# EAGLE design Robot arm (EAGLE 8.4.2)
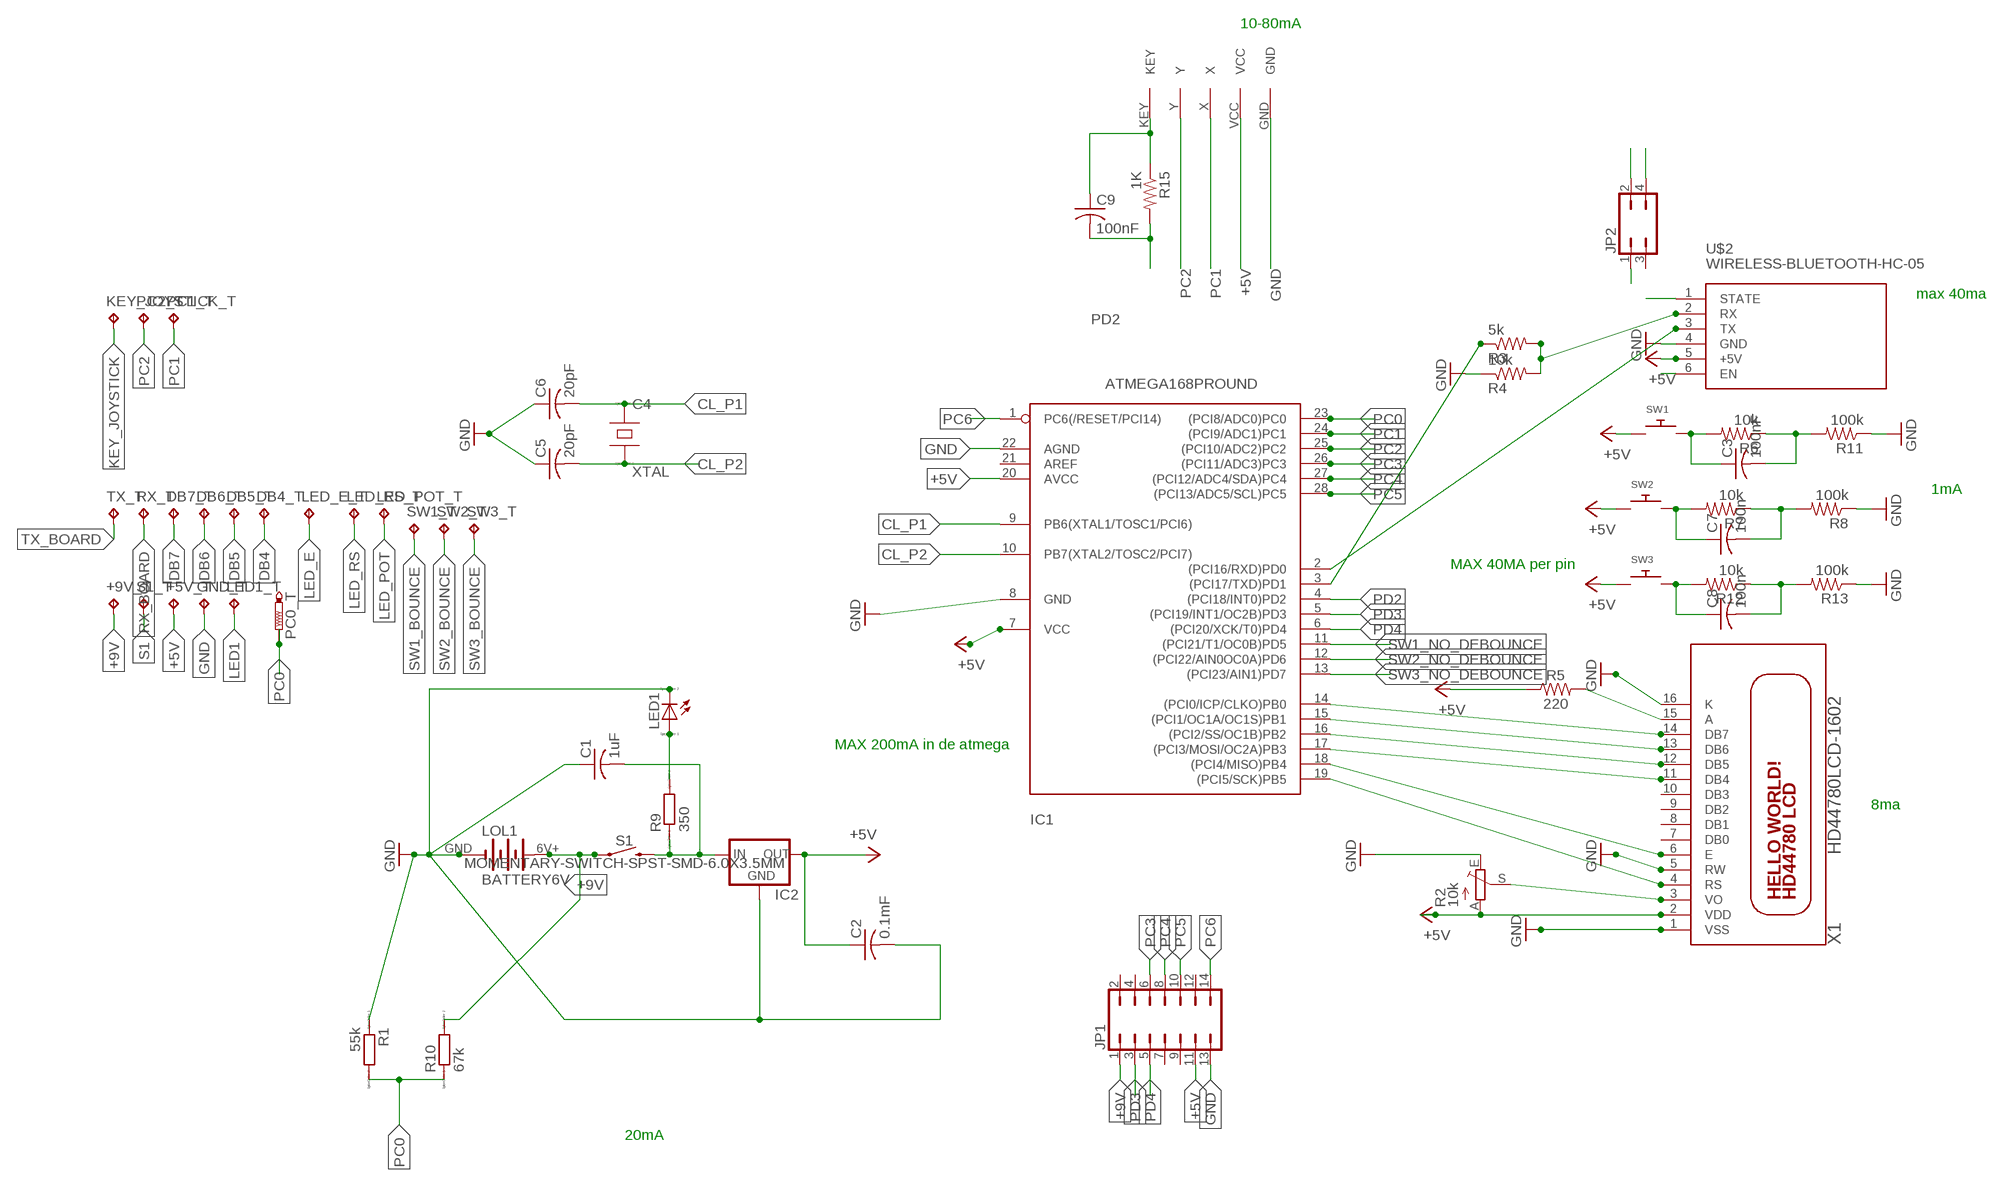
[diagram p0: schematic, sheet 1]

## Parts
+5V_T  TPB1,27  [B1,27]
+9V_T  TPB1,27  [B1,27]
C1  1uF  C-US025-025X050  [C025-025X050]
C2  0.1mF  C-US025-025X050  [C025-025X050]
C3  100nF  C-US025-025X050  [C025-025X050]
C4  XTAL  [HC49UP]
C5  20pF  C-US025-025X050  [C025-025X050]
C6  20pF  C-US025-025X050  [C025-025X050]
C7  100n  C-US025-025X050  [C025-025X050]
C8  100n  C-US025-025X050  [C025-025X050]
C9  100nF  C-US025-025X050  [C025-025X050]
DB4_T  TPB1,27  [B1,27]
DB5_T  TPB1,27  [B1,27]
DB6_T  TPB1,27  [B1,27]
DB7_T  TPB1,27  [B1,27]
GND_T  TPB1,27  [B1,27]
IC1  ATMEGA168PROUND  [DIL28-3-ROUND]
IC2  MCP1700INLINE  [TO92-INLINE]
JP1  JP7Q  [JP7Q]
JP2  JP2Q  [JP2Q]
KEY_JOYSTICK_T  TPB1,27  [B1,27]
LED1  LED_E  [LED_1206]
LED1_T  TPB1,27  [B1,27]
LED_E_T  TPB1,27  [B1,27]
LED_POT_T  TPB1,27  [B1,27]
LED_RS_T  TPB1,27  [B1,27]
LOL1  BATTERY6V  [BATTERY6PACK]
PC0_T  PTR1B1,27  [B1,27]
PC1_T  TPB1,27  [B1,27]
PC2_T  TPB1,27  [B1,27]
R1  55k  R  [R0805]
R2  10k  TRIM_EU-B25V  [B25V]
R3  5k  R-US_0204/5  [0204/5]
R4  10k  R-US_0204/5  [0204/5]
R5  220  220OHM-0603-1/10W-1%  [0603]
R6  10k  R-US_0204/5  [0204/5]
R7  10k  R-US_0204/5  [0204/5]
R8  100k  R-US_0204/5  [0204/5]
R9  350  R  [R0805]
R10  67k  R  [R0805]
R11  100k  R-US_0204/5  [0204/5]
R12  10k  R-US_0204/5  [0204/5]
R13  100k  R-US_0204/5  [0204/5]
R15  1K  R-US_0204/5  [0204/5]
RX_T  TPB1,27  [B1,27]
S1  MOMENTARY-SWITCH-SPST-SMD-6.0X3.5MM  [TACTILE_SWITCH_SMD_6.0X3.5MM]
S1_T  TPB1,27  [B1,27]
SW1  SWITCH_PUSHBUTTONSOFTTOUCHSMD_SJ  [PUSHBUTTON_SMD_SJ]
SW1_T  TPB1,27  [B1,27]
SW2  SWITCH_PUSHBUTTONSOFTTOUCHSMD_SJ  [PUSHBUTTON_SMD_SJ]
SW2_T  TPB1,27  [B1,27]
SW3  SWITCH_PUSHBUTTONSOFTTOUCHSMD_SJ  [PUSHBUTTON_SMD_SJ]
SW3_T  TPB1,27  [B1,27]
TX_T  TPB1,27  [B1,27]
U$1  JOYSTICK  [JOYSTICK]
U$2  WIRELESS-BLUETOOTH-HC-05  [WIRELESS-BLUETOOTH-HC-05]
X1  HD44780LCD-1602  [LCD1602]

## Nets
+5V: +5V_T.TP C2.1 IC1.7(VCC) IC1.20(AVCC) IC2.3(OUT) JP1.11 R2.A R5.1 SW1.P$1 SW2.P$1 SW3.P$1 U$1.VCC U$2.5(+5V) X1.2(VDD)
+9V: +9V_T.TP JP1.1 LOL1.6V+(6V) R10.2 S1.1
CL_P1: C4.1(A) C6.2 IC1.9(PB6(XTAL1/TOSC1/PCI6))
CL_P2: C4.2(B) C5.2 IC1.10(PB7(XTAL2/TOSC2/PCI7))
DB4: DB4_T.TP IC1.17((PCI3/MOSI/OC2A)PB3) X1.11(DB4)
DB5: DB5_T.TP IC1.16((PCI2/SS/OC1B)PB2) X1.12(DB5)
DB6: DB6_T.TP IC1.15((PCI1/OC1A/OC1S)PB1) X1.13(DB6)
DB7: DB7_T.TP IC1.14((PCI0/ICP/CLKO)PB0) X1.14(DB7)
EN: JP2.4 U$2.6(EN)
GND: C1.1 C2.2 C5.1 C6.1 GND_T.TP IC1.8(GND) IC1.22(AGND) IC2.1(GND) JP1.13 JP2.1 LED1.C LOL1.GND R1.1 R2.E R4.1 R8.1 R11.1 R13.1 U$1.GND U$2.4(GND) X1.1(VSS) X1.5(RW) X1.16(K)
KEY_JOYSTICK: C9.1 KEY_JOYSTICK_T.TP R15.1 U$1.KEY
LED1: LED1.A LED1_T.TP R9.2
LED_E: IC1.18((PCI4/MISO)PB4) LED_E_T.TP X1.6(E)
LED_POT: LED_POT_T.TP R2.S X1.3(VO)
LED_RS: IC1.19((PCI5/SCK)PB5) LED_RS_T.TP X1.4(RS)
N$12: R5.2 X1.15(A)
PC0: IC1.23((PCI8/ADC0)PC0) PC0_T.TP R1.2 R10.1
PC1: IC1.24((PCI9/ADC1)PC1) PC1_T.TP U$1.X
PC2: IC1.25((PCI10/ADC2)PC2) PC2_T.TP U$1.Y
PC3: IC1.26((PCI11/ADC3)PC3) JP1.6
PC4: IC1.27((PCI12/ADC4/SDA)PC4) JP1.8
PC5: IC1.28((PCI13/ADC5/SCL)PC5) JP1.10
PC6: IC1.1(PC6(/RESET/PCI14)) JP1.14
PD2: C9.2 IC1.4((PCI18/INT0)PD2) R15.2
PD3: IC1.5((PCI19/INT1/OC2B)PD3) JP1.3
PD4: IC1.6((PCI20/XCK/T0)PD4) JP1.5
RX: R3.2 R4.2 U$2.2(RX)
RX_BOARD: IC1.2((PCI16/RXD)PD0) RX_T.TP U$2.3(TX)
S1: C1.2 IC2.2(IN) R9.1 S1.2 S1_T.TP
STATE: JP2.2 U$2.1(STATE)
SW1_BOUNCE: C3.1 R6.2 SW1.P$2 SW1_T.TP
SW1_NO_DEBOUNCE: C3.2 IC1.11((PCI21/T1/OC0B)PD5) R6.1 R11.2
SW2_BOUNCE: C7.1 R7.2 SW2.P$2 SW2_T.TP
SW2_NO_DEBOUNCE: C7.2 IC1.12((PCI22/AIN0OC0A)PD6) R7.1 R8.2
SW3_BOUNCE: C8.1 R12.2 SW3.P$2 SW3_T.TP
SW3_NO_DEBOUNCE: C8.2 IC1.13((PCI23/AIN1)PD7) R12.1 R13.2
TX_BOARD: IC1.3((PCI17/TXD)PD1) R3.1 TX_T.TP
Unconnected: IC1.21(AREF) JP1.2 JP1.4 JP1.7 JP1.9 JP1.12 JP2.3 X1.7(DB0) X1.8(DB1) X1.9(DB2) X1.10(DB3)

## Notes on the sheet
- 10-80mA
- max 40ma
- 1mA
- MAX 40MA per pin
- MAX 200mA in de atmega
- 8ma
- 20mA

## Library data of the parts
+5V_T +9V_T DB4_T DB5_T DB6_T DB7_T GND_T KEY_JOYSTICK_T LED1_T LED_E_T LED_POT_T LED_RS_T PC1_T PC2_T RX_T S1_T SW1_T SW2_T SW3_T TX_T = testpad:TP: Test pad
C1-C3 C5-C9 = adafruit:C-US: CAPACITOR, American symbol
C4 = Misc:XTAL: Piezoelectric crystal. Set C, Lser and Cpar to set series and parallel resonances. This is actually the same as a capacitor.
IC1 = adafruit:ATMEGA168*P: MICROCONTROLLER 16 kBytes FLASH 1 kBytes SRAM 512 Bytes EEPROM USART 8-channel 10 bit ADC
IC2 = adafruit:MCP1700: VOLTAGE REGULATOR
JP1 = jumper:JP7Q: JUMPER
JP2 = jumper:JP2Q: JUMPER
LED1 = eagle-ltspice:LED_E: LED Source: http://www.osram.convergy.de Source: www.luxeon.com Source: www.kingbright.com; SPICEMODEL: NONE; SPICEPREFIX: D; SPICETYPE: diode
LOL1 = batterypack6v:BATTERY6V
PC0_T = testpad:PTR1: TEST PIN
R1 R9 R10 = eagle-ltspice:R: RESISTOR, European symbol; SPICEMODEL: NONE; SPICEPREFIX: R
R2 = pot:TRIM_EU-: POTENTIOMETER
R3 R4 R6-R8 R11-R13 R15 = adafruit:R-US_: RESISTOR, American symbol
R5 = SparkFun-Resistors:220OHM: 220Ω resistor A resistor is a passive two-terminal electrical component that implements electrical resistance as a circuit element. Resistors act to reduce current flow, and, at the same time, act to lower voltage levels within circuits. - Wikipedia; PROD_ID: RES-07861
S1 = SparkFun-Switches:MOMENTARY-SWITCH-SPST: Momentary Switch (Pushbutton) - SPST Normally-open (NO) SPST momentary switches (buttons, pushbuttons). Variants PTH-12MM - 12mm square, through-hole Momentary Pushbutton Switch - 12mm Square <https://www.sparkfun.com/products/9190> (COM-09190) PTH-6.0MM, PTH-6.0MM-KIT - 6.0mm square, through-hole Mini Pushbutton Switch <https://www.sparkfun.com/products/97> (COM-00097) KIT package intended for soldering kit's - only one side of pads' copper is exposed. PTH-RIGHT-ANGLE-KIT - Right-angle, through-hole Right Angle Tactile Button <https://www.sparkfun.com/products/10791> - Used on SparkFun BigTime Watch Kit <https://www.sparkfun.com/products/11734> SMD-12MM - 12mm square, surface-mount Tactile Button - SMD (12mm) <https://www.sparkfun.com/products/12993> (COM-12993) Used on SparkFun PicoBoard <https://www.sparkfun.com/products/11888> SMD-4.5MM - 4.5mm Square Trackball Switch Used on SparkFun Blackberry Trackballer Breakout <https://www.sparkfun.com/products/13169> SMD-4.6MMX2.8MM - 4.60mm x 2.80mm, surface mount Used on SparkFun SAMD21 Mini Breakout <https://www.sparkfun.com/products/13664> SMD-5.2MM, SMD-5.2-REDUNDANT - 5.2mm square, surface-mount Mini Pushbutton Switch - SMD <https://www.sparkfun.com/products/8720> (COM-08720) Used on Arduino Pro Mini <https://www.sparkfun.com/products/11114> REDUNDANT package connects both switch circuits together SMD-6.0X3.5MM - 6.0 x 3.5mm, surface mount Momentary Reset Switch SMD <https://www.sparkfun.com/products/8229> (COM-08229) SMD-6.2MM-TALL - 6.2mm square, surface mount Tactile Button - SMD (6mm) <https://www.sparkfun.com/products/12992> Used on SparkFun Digital Sandbox <https://www.sparkfun.com/products/12651> SMD-RIGHT-ANGLE - Right-angle, surface mount Used on SparkFun Block for Intel® Edison - Arduino <https://www.sparkfun.com/products/13036>; PROD_ID: SWCH-00815; SF_SKU: COM-08229
SW1-SW3 = adafruit:SWITCH_PUSHBUTTON: Buttons SOFTTOUCHSMD_SJ - Soft touch temporary push button (Super Junk Akihabara) Compatible with SKPMANE010 [Mouser: 688-SKPMAN] C&K_KSS = Digikey: KSS221GLFS
U$1 = joystick:JOYSTICK
U$2 = diy-modules:WIRELESS-BLUETOOTH-HC-05: Bluetooth Transceiver Module based on HC-05 board Tutorial is available here: https://arduino-info.wikispaces.com/BlueTooth-HC05-HC06-Modules-How-To Click here to find device on ebay.com <http://www.ebay.com/sch/hc-05+module+rs232>
X1 = adafruit:HD44780LCD: HD44780 LCD Standard character type LCDs, available in sizes from 8x1 to 40x4!

## Net classes
0 default: width 0.035 mm
1 +5V: width 117 mm
2 GND: width 117 mm

## Board
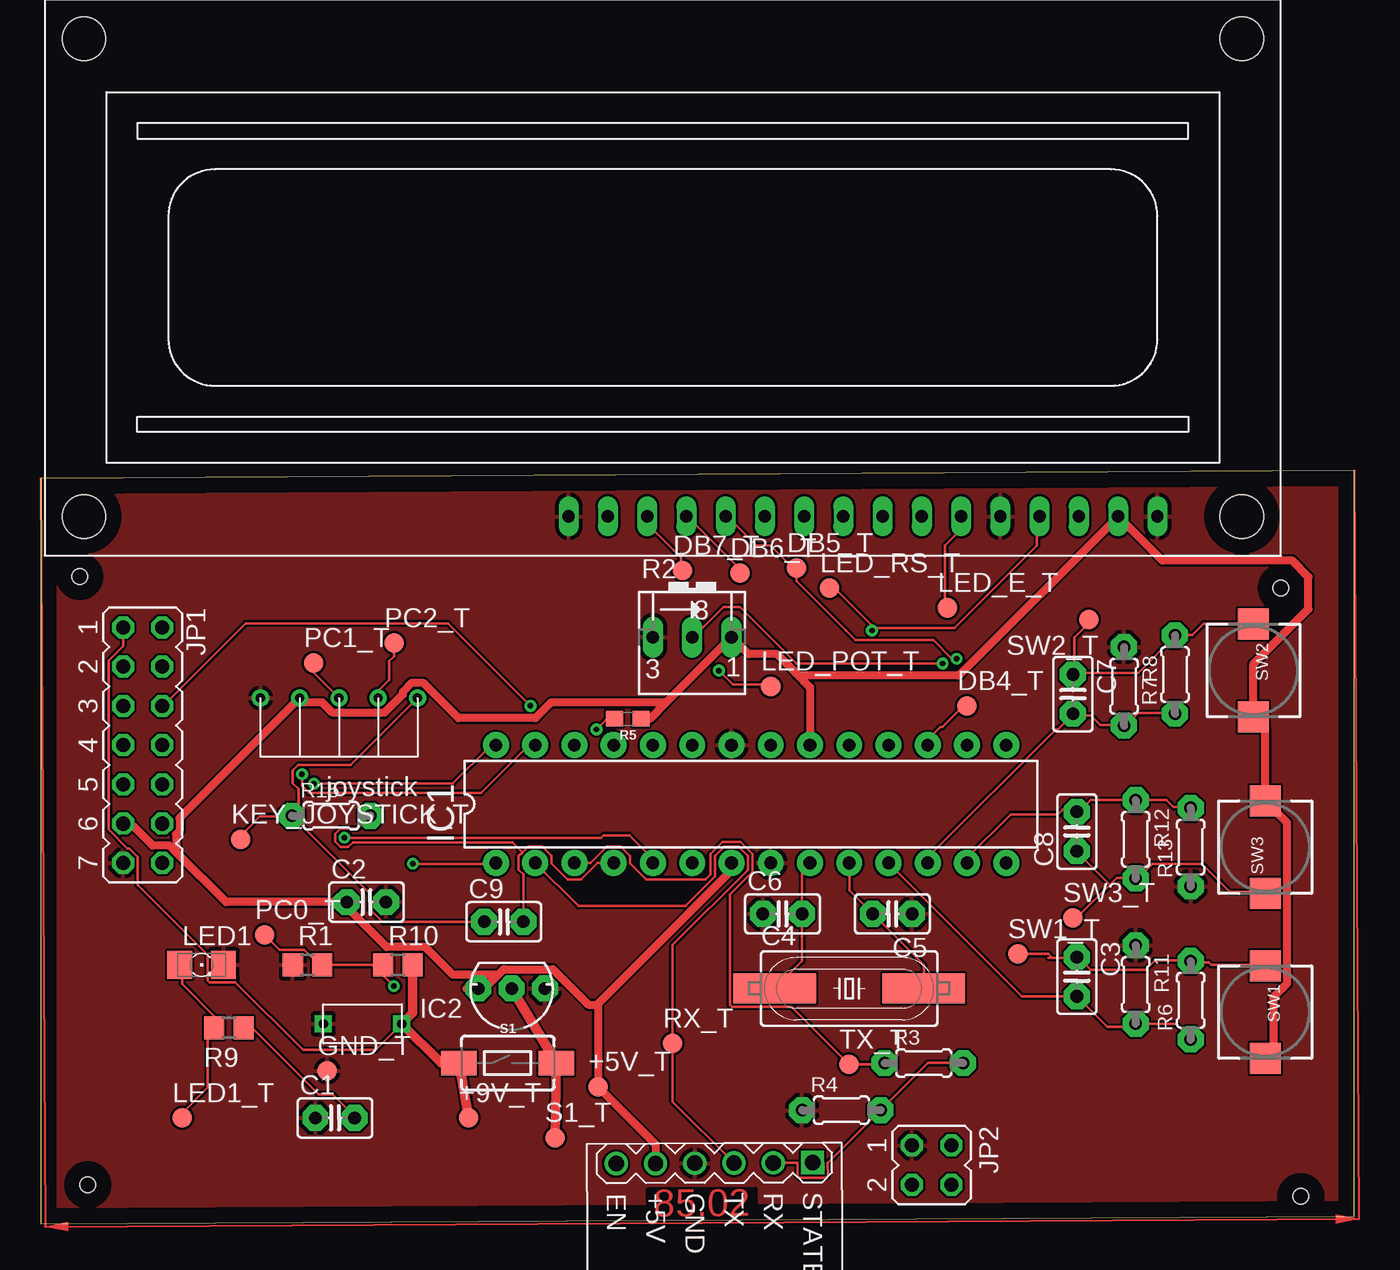
[diagram p1: board, top side]
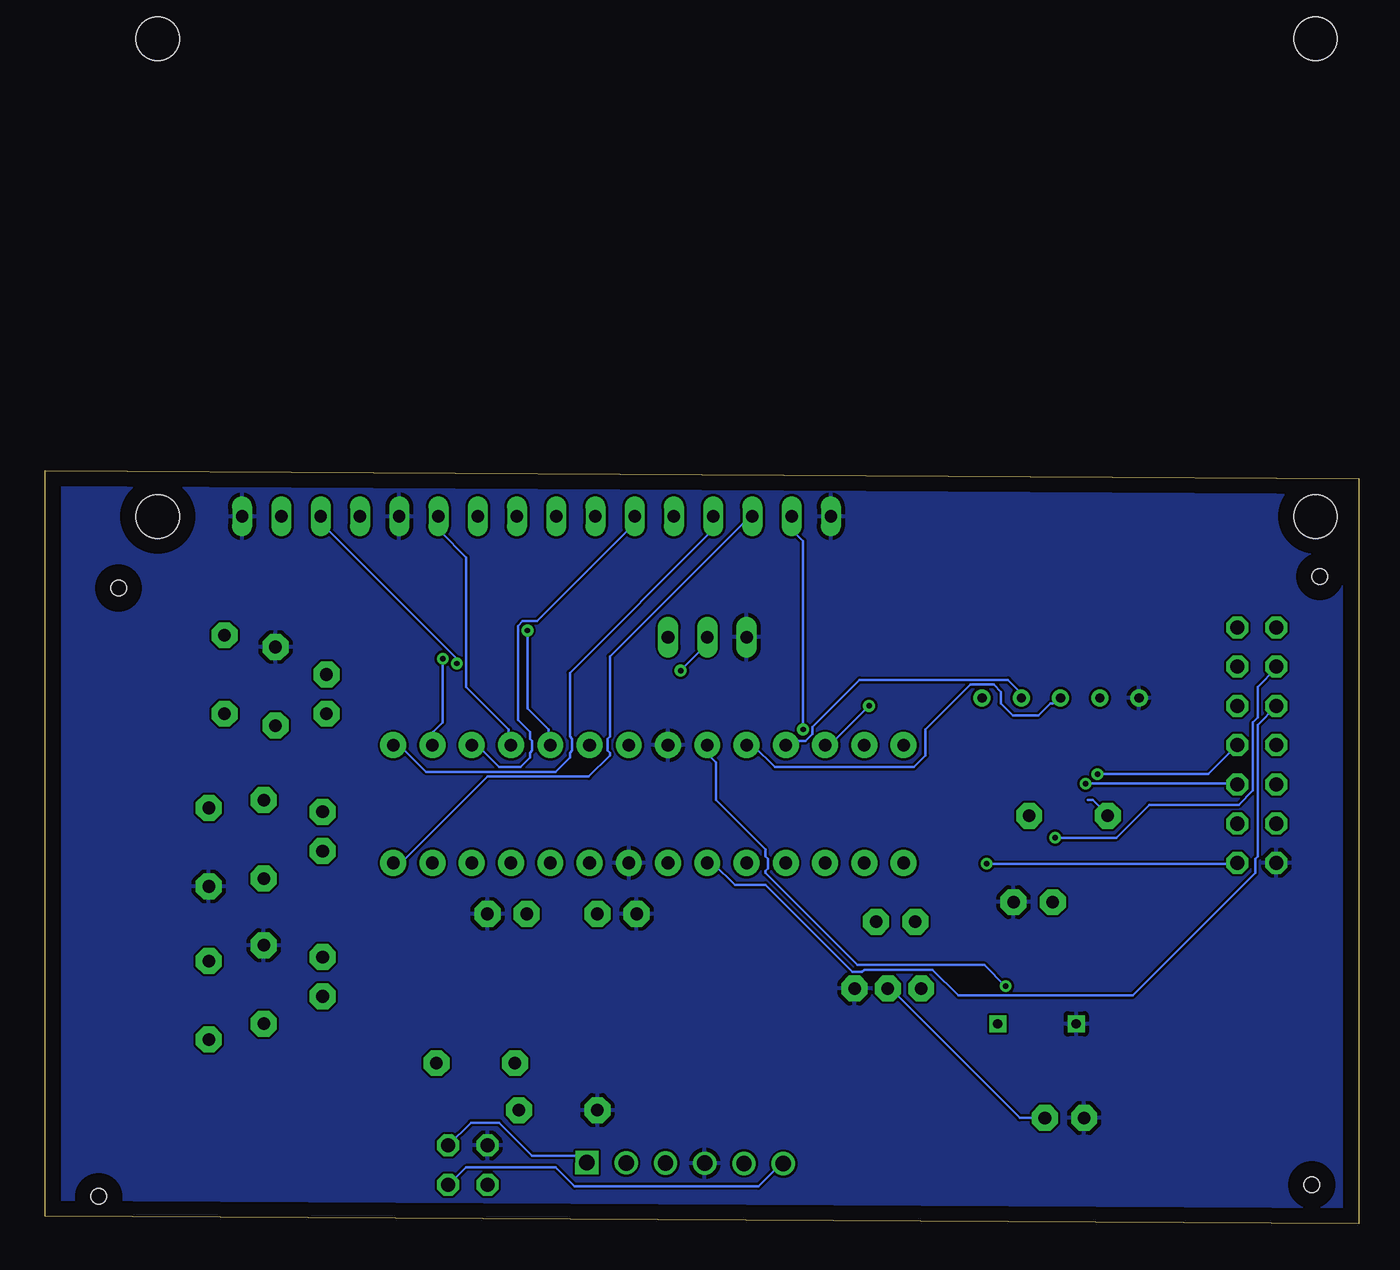
[diagram p2: board, bottom side, seen from below]

Size 85.01 x 48.76 mm. Coordinates in mm from the lower left corner, seen from the top.
Outline: 0,0 85.01,0.51 85.01,48.76 0,48.25 0,0
Copper layers (1*16): Top 0.035mm / dielectric 1.5mm / Bottom 0.035mm
Design rules "default": minimum track width 6mil, minimum drill 0.35mm, track to track 6mil, track to pad 6mil, pad to pad 6mil, via to via 6mil, smd to smd 6mil, copper to edge 40mil, drill to drill 6mil, minimum pad ring 10mil, minimum via ring 8mil, stop-mask expansion 4mil, vias tented up to drill 0mil, thermal gap 10mil
Holes 1 mm at 3.05,2.54 81.53,1.78 80.26,41.15 2.54,41.91

### Footprints (pad centres in the part's own frame; a part is rotated, then mirrored left to right if it is on the bottom)
B1,27 = smd 1.27 x 1.27: TP 0,0
C025-025X050 = drill 0.813 pad 1.676 octagon: 1 -1.27,0; 2 1.27,0
HC49UP = smd 5.334 x 1.93: 1 -4.826,0; 2 4.826,0
DIL28-3-ROUND = drill 0.813 pad 1.676: 1 -16.51,-3.81; 2 -13.97,-3.81; 3 -11.43,-3.81; 4 -8.89,-3.81; 5 -6.35,-3.81; 6 -3.81,-3.81; 7 -1.27,-3.81; 8 1.27,-3.81; 9 3.81,-3.81; 10 6.35,-3.81; 11 8.89,-3.81; 12 11.43,-3.81; 13 13.97,-3.81; 14 16.51,-3.81; 15 16.51,3.81; 16 13.97,3.81; 17 11.43,3.81; 18 8.89,3.81; 19 6.35,3.81; 20 3.81,3.81; 21 1.27,3.81; 22 -1.27,3.81; 23 -3.81,3.81; 24 -6.35,3.81; 25 -8.89,3.81; 26 -11.43,3.81; 27 -13.97,3.81; 28 -16.51,3.81
TO92-INLINE = drill 0.813 pad 1.676 octagon: 1 -2.159,0; 2 0,0; 3 2.159,0
JP7Q = drill 0.914 octagon: 1 -7.62,-1.27; 2 -7.62,1.27; 3 -5.08,-1.27; 4 -5.08,1.27; 5 -2.54,-1.27; 6 -2.54,1.27; 7 0,-1.27; 8 0,1.27; 9 2.54,-1.27; 10 2.54,1.27; 11 5.08,-1.27; 12 5.08,1.27; 13 7.62,-1.27; 14 7.62,1.27
JP2Q = drill 0.914 octagon: 1 -1.27,-1.27; 2 -1.27,1.27; 3 1.27,-1.27; 4 1.27,1.27
LED_1206 = smd 1.6 x 1.803: A -1.422,0; C 1.422,0
BATTERY6PACK = drill 0.6 square: 6V+ 1.27,0; GND -3.81,0
R0805 = smd 1.3 x 1.5: 1 -0.95,0; 2 0.95,0
B25V = drill 0.813 long: A 2.54,0.635; E -2.54,0.635; S 0,0.635
0204/5 = drill 0.813 pad 1.676 octagon: 1 -2.54,0; 2 2.54,0
0603 = smd 1.1 x 1: 1 -0.85,0; 2 0.85,0
TACTILE_SWITCH_SMD_6.0X3.5MM = smd 2.3 x 1.6: 1 -3.15,0; 2 3.15,0
PUSHBUTTON_SMD_SJ = smd 2 x 2: P$1 3,0; P$2 -3,0
JOYSTICK = drill 0.6: GND 6.35,0; KEY -3.81,0; VCC 3.81,0; X 1.27,0; Y -1.27,0
WIRELESS-BLUETOOTH-HC-05 = drill 1 square: 1 -6.35,-17.145 | drill 1: 2 -3.81,-17.145; 3 -1.27,-17.145; 4 1.27,-17.145; 5 3.81,-17.145; 6 6.35,-17.145
LCD1602 = drill 0.8 long: 1 8,33.46; 2 10.54,33.46; 3 13.08,33.46; 4 15.62,33.46; 5 18.16,33.46; 6 20.7,33.46; 7 23.24,33.46; 8 25.78,33.46; 9 28.32,33.46; 10 30.86,33.46; 11 33.4,33.46; 12 35.94,33.46; 13 38.48,33.46; 14 41.02,33.46; 15 43.56,33.46; 16 46.1,33.46 | hole 2.8: 2.54,2.54; 2.54,33.46; 77.46,33.46; 77.46,2.54

### Placement (x,y rotation side)
+5V_T  36.07,8.89 0 top
+9V_T  27.69,6.86 0 top
C1  19.05,6.86 0 top
C2  21.08,20.83 0 top
C3  67.06,16 270 top
C4  52.32,15.24 0 top
C5  55.12,20.07 180 top
C6  48.01,20.07 0 top
C7  66.8,34.29 270 top
C8  67.06,25.4 90 top
C9  29.97,19.56 0 top
DB4_T  59.94,33.53 0 top
DB5_T  48.91,42.45 0 top
DB6_T  45.24,42.12 0 top
DB7_T  41.55,42.29 0 top
GND_T  18.54,9.91 0 top
IC1  45.97,27.18 0 top
IC2  30.48,15.24 180 top
JP1  6.6,30.99 270 top
JP2  57.66,3.81 270 top
KEY_JOYSTICK_T  12.95,24.89 0 top
LED1  10.41,16.76 0 top
LED1_T  9.14,6.86 0 top
LED_E_T  58.67,39.88 0 top
LED_POT_T  47.24,34.8 0 top
LED_RS_T  51.05,41.15 0 top
LOL1  22.1,12.95 0 top
PC0_T  14.49,18.71 0 top
PC1_T  17.65,36.31 0 top
PC2_T  22.86,37.59 0 top
R1  17.27,16.76 0 top
R2  42.16,37.34 0 top
R3  57.15,10.41 0 top
R4  51.82,7.37 0 top
R5  38,32.69 180 top
R6  74.42,14.48 90 top
R7  73.41,35.56 90 top
R8  70.1,34.8 270 top
R9  12.19,12.7 180 top
R10  23.11,16.76 0 top
R11  70.87,15.49 270 top
R12  70.87,24.89 270 top
R13  74.42,24.38 90 top
R15  18.8,26.42 0 top
RX_T  40.89,11.68 0 top
S1  30.23,10.41 0 top
S1_T  33.27,5.59 0 top
SW1  79.25,13.72 270 top
SW1_T  63.23,17.47 0 top
SW2  78.49,35.81 270 top
SW2_T  67.82,39.12 180 top
SW3  79.25,24.38 90 top
SW3_T  66.8,19.81 0 top
TX_T  52.32,10.32 0 top
U$1  20.57,34.04 180 top
U$2  43.69,-13.21 180.3 top
X1  80.26,79.25 180 top

### Tracks (layer width: path | path; a pad name or v marks a point on that pad's centre or on a via)
+5V
  Top 0.508: 27.56,15.24 IC2.3 28.72,15.24 29.61,16.13 | R5.1 39.42,32.69 40.48,33.75 | 40.48,33.75 R2.A 45.81,36.87 47.64,36.87 48.86,35.65 | SW1.P$1 79.3,10.76 79.76,10.76 79.76,14.65 80.65,15.55 80.65,25.98 SW3.P$1 79.25,32.05 SW2.P$1 78.49,36.24 82.03,39.79 82.03,41.88 81,42.92 72.59,42.92 X1.2 59.42,35.49 49.02,35.49 48.86,35.65 | 36.02,14.18 35.46,14.18 33.16,16.48 29.96,16.48 29.61,16.13 | 36.02,14.18 36.07,14.13 +5V_T.TP 39.79,5.17 U$2.5 | 36.02,14.18 44.7,22.87 IC1.7 | 29.61,16.13 26.68,16.13 24.88,17.92 22.38,17.92 19.47,20.83 C2.1 12,20.83 8.77,24.05 | 8.77,24.05 8.34,24.49 7.25,24.49 5.97,25.76 5.48,25.76 JP1.11 | 16.48,33.75 8.99,26.26 8.99,25.44 8.77,25.22 8.77,24.05 | 16.48,33.75 U$1.VCC | 40.48,33.75 33.03,33.75 32.02,32.74 27.04,32.74 24.78,35 23.99,35 23.42,34.43 23.42,34.26 22.24,33.08 18.91,33.08 18.23,33.75 16.48,33.75 | 48.86,35.65 49.78,34.72 IC1.20
+9V
  Top 0.152: JP1.1 5.33,37.4 4.39,36.46 4.39,25.52 5.61,24.31 5.72,24.31 6.27,23.76 6.27,21.96 10.81,17.43 10.81,15.77 10.94,15.63 12.6,15.63 16.97,11.26 21.67,11.26 LOL1.6V+
  Top 0.61: R10.2 24.06,13.65 LOL1.6V+ 25.91,10.41 S1.1 +9V_T.TP
CL_P1
  Top 0.152: IC1.9 49.28,22.86 C6.2 49.28,17.02 C4.1
CL_P2
  Top 0.152: IC1.10 52.32,21.59 C5.2 57.15,16.76 C4.2
DB4
  Top 0.152: DB4_T.TP 59.89,33.53 59.59,33.22 59.44,33.22 58.37,32.16 58.22,32.16 57.45,31.39 57.45,31.09 IC1.17
  Bottom 0.152: X1.11 46.94,45.72 46.94,45.26 53.19,39.01 54.1,39.01 54.41,38.71 54.41,32.61 53.65,31.85 53.65,31.39 53.49,31.24 53.49,30.63 53.65,30.48 53.65,30.18 54.25,29.57 55.63,29.57 57,30.94 57.3,30.94 IC1.17
DB5  (via drill 0.35)
  Top 0.152: 48.62,42.52 48.77,42.52 | 48.62,42.52 47.24,43.89 46.33,43.89 44.35,45.87 X1.12 | v59.28,36.58 58.98,36.58 57.76,37.8 52.73,37.8 52.12,38.41 | 48.91,41.61 52.12,38.41 | 48.91,41.61 52.12,38.41 | 48.91,41.61 DB5_T.TP 48.68,42.45 48.62,42.52
  Bottom 0.152: v59.28,36.58 59.28,32.46 59.89,31.85 59.89,31.09 IC1.16
DB6
  Top 0.152: DB6_T.TP 45.11,42.21 45.11,42.52 41.91,45.72 X1.13
  Bottom 0.152: IC1.15 62.48,30.94 62.03,30.94 60.35,29.26 51.97,29.26 51.05,30.18 51.05,30.48 50.9,30.63 50.9,31.39 51.05,31.55 51.05,35.66 41.91,44.81 41.91,45.72 X1.13
DB7
  Top 0.152: DB7_T.TP 41.45,42.37 41.45,43.13 39.32,45.26 39.32,45.72 X1.14
  Bottom 0.152: IC1.14 62.48,23.47 61.87,23.47 56.39,28.96 49.84,28.96 48.46,30.33 48.46,30.48 48.62,30.63 48.62,31.39 48.46,31.55 48.46,36.73 39.32,45.87 X1.14
EN
  Bottom 0.152: JP2.4 58.83,2.59 57.76,3.66 51.97,3.66 50.75,2.44 38.86,2.44 37.34,3.96 U$2.6
GND
  pour Top: -7.37,-1.52 87.63,-2.29 86.11,49.78 -7.62,49.53
  pour Bottom: -9.14,-3.3 88.65,-3.56 88.39,51.31 -9.4,51.56
KEY_JOYSTICK
  Top 0.152: KEY_JOYSTICK_T.TP 12.95,24.99 13.26,25.3 13.26,25.45 14.17,26.36 16.15,26.36 R15.1 16.69,25.98 | 16.69,25.98 21.29,21.39 21.29,20.39 22.11,19.56 C9.1 | 16.69,25.98 16.69,28.14 16.31,28.52 16.31,29.36 16.67,29.71 20.06,29.71 U$1.KEY
  Bottom 0.152: 24.08,33.98 24.38,33.98 U$1.KEY | 17.53,27.43 17.22,27.43 16.31,26.52 R15.1 | 28.65,19.66 C9.1
LED1
  Top 0.152: LED1_T.TP 9.14,7.16 10.82,8.84 10.82,12.34 11.12,12.65 R9.2 11.28,12.8 11.28,13.41 9.14,15.54 9.14,16.76 LED1.A
LED_E
  Top 0.152: LED_E_T.TP 58.67,40.39 58.52,40.54 58.52,43.89 59.44,44.81 59.44,45.72 X1.6
  Bottom 0.152: IC1.18 54.86,31.7 55.02,31.85 55.02,32 57.76,34.75 57.76,43.13 59.44,44.81 59.44,45.72 X1.6
LED_POT  (via drill 0.35)
  Top 0.152: v43.89,35.81 44.81,34.9 47.24,34.9 LED_POT_T.TP | v58.37,36.27 48.92,36.27 45.26,39.93 44.2,39.93 42.22,37.95 R2.S
  Bottom 0.152: v43.89,35.81 42.22,37.49 42.22,37.95 R2.S | v58.37,36.27 58.37,36.58 67.06,45.26 67.06,45.72 X1.3
LED_RS  (via drill 0.35)
  Top 0.152: LED_RS_T.TP 51.36,41.15 53.95,38.56 | 53.95,38.56 59.13,38.56 64.47,43.89 64.47,45.57 64.62,45.72 X1.4 | 53.95,38.56 v53.8,38.41
  Bottom 0.152: v53.8,38.41 53.8,33.38 52.43,32 52.43,31.09 IC1.19
N$12  (via drill 0.35)
  Top 0.152: v35.97,32 36.58,32.61 37.03,32.61 R5.2
  Bottom 0.152: v35.97,32 35.97,44.2 36.58,44.81 36.58,45.72 X1.15
PC0  (via drill 0.35)
  Top 0.152: 18.47,16.76 R1.2 | 18.47,16.76 R10.1 22.25,16.76 22.25,16 v22.86,15.39 | PC0_T.TP 15.45,17.74 17.07,17.74 18.04,16.76 18.47,16.76
  Bottom 0.152: v22.86,15.39 24.23,16.76 32.46,16.76 38.41,22.71 38.41,22.86 38.25,23.01 38.25,23.62 38.41,23.77 38.41,24.23 41.61,27.43 41.61,29.87 42.06,30.33 42.06,30.94 IC1.23
PC1
  Top 0.152: PC1_T.TP 17.65,35.69 U$1.X
  Bottom 0.152: U$1.X 19.36,33.98 19.51,33.98 19.81,33.68 19.96,33.68 20.73,32.92 22.4,32.92 23.17,33.68 23.17,34.44 23.62,34.9 25.15,34.9 28.04,32 28.04,30.33 28.8,29.57 37.8,29.57 39.17,30.94 39.62,30.94 IC1.24
PC2
  Top 0.152: PC2_T.TP 22.86,36.73 22.56,36.42 22.56,35.2 21.95,34.59 21.95,34.14 U$1.Y
  Bottom 0.152: U$1.Y 21.95,34.14 21.95,34.44 22.71,35.2 32.31,35.2 35.36,32.16 35.36,31.7 35.81,31.24 36.88,31.24 37.03,31.09 IC1.25
PC3  (via drill 0.35)
  Top 0.152: v31.7,33.53 26.36,38.86 13.26,38.86 7.93,33.53 JP1.6
  Bottom 0.152: v31.7,33.53 34.14,31.09 34.44,31.09 IC1.26
PC4  (via drill 0.35)
  Top 0.152: v16.92,29.11 16.92,28.35 17.37,27.89 28.5,27.89 31.55,30.94 32,30.94 IC1.27
  Bottom 0.152: JP1.8 9.75,29.11 v16.92,29.11
PC5  (via drill 0.35)
  Top 0.152: v17.68,28.5 26.67,28.5 29.11,30.94 29.41,30.94 IC1.28
  Bottom 0.152: v17.68,28.5 7.93,28.5 JP1.10
PC6  (via drill 0.35)
  Top 0.152: IC1.1 29.41,23.32 v24.08,23.32
  Bottom 0.152: v24.08,23.32 7.93,23.32 JP1.14
PD2
  Top 0.152: 31.18,24.05 30.94,23.81 30.94,22.93 31.24,22.62 C9.2 | 31.18,24.05 31.56,24.43 32.45,24.43 33.07,23.81 33.07,23.33 34.1,22.3 34.99,22.3 36.05,23.37 IC1.4 | 31.18,24.05 30.54,24.69 20.21,24.69 19.91,24.39 19.41,24.39 19.05,24.74 19.05,25.25 19.41,25.6 20.52,25.6 R15.2
PD3  (via drill 0.35)
  Top 0.152: v19.66,24.99 36.27,24.99 36.42,25.15 38.1,25.15 39.62,23.62 IC1.5
  Bottom 0.152: v19.66,24.99 15.7,24.99 13.56,27.13 7.77,27.13 6.86,28.04 6.86,32.46 6.55,32.77 6.55,34.75 5.33,35.97 JP1.3
PD4
  Bottom 0.152: JP1.5 6.55,32.31 6.55,23.77 6.71,23.62 6.71,22.71 14.63,14.78 25.91,14.78 27.58,16.46 32,16.46 32.16,16.31 32.77,16.31 38.41,21.95 40.39,21.95 41.76,23.32 42.06,23.32 IC1.6
RX
  Top 0.152: U$2.2 48.97,3.96 48.97,3.12 49.11,2.98 50.8,2.99 50.94,3.13 50.93,3.96 50.95,3.96 R4.2 57.4,10.41 R3.2
RX_BOARD
  Top 0.152: U$2.3 40.89,7.92 RX_T.TP 40.89,18.05 45.77,22.93 45.77,23.81 45.15,24.43 44.26,24.43 43.64,23.81 43.64,22.49 41.73,20.57 34.8,20.57 IC1.2
S1
  Top 0.152: R9.1 13.26,12.65 13.72,12.65 17.98,8.38 18.9,8.38 20.42,6.86 C1.2
  Top 0.61: IC2.2 S1.2 S1_T.TP
  Bottom 0.152: IC2.2 30.02,14.78 29.87,14.78 21.95,6.86 C1.2
STATE
  Bottom 0.152: JP2.2 57.45,6.55 55.63,6.55 53.49,4.42 50.29,4.42 49.99,4.11 U$2.1
SW1_BOUNCE
  Top 0.152: SW1.P$2 79.25,16.76 75.74,16.76 75.59,16.92 74.52,16.92 R6.2 74.37,17.07 72.09,17.07 71.48,16.46 67.97,16.46 67.06,17.37 C3.1 67.06,17.22 65.47,17.22 | 65.47,17.22 65.23,17.22 | SW1_T.TP 65.23,17.47 65.47,17.22
SW1_NO_DEBOUNCE
  Top 0.152: 70.97,12.95 73.46,12.95 74.37,12.04 R6.1 | 70.97,12.95 R11.2 | IC1.11 63.5,14.73 C3.2 69.03,12.76 70.78,12.76 70.97,12.95
SW2_BOUNCE
  Top 0.152: 66.9,35.66 66.9,37.95 67.51,38.56 67.51,38.71 67.82,39.01 SW2_T.TP | 66.9,35.66 C7.1 | R7.2 74.52,38.1 75.29,38.86 78.49,38.86 SW2.P$2 | 66.9,35.66 71.02,35.66 73.46,38.1
  Bottom 0.152: 66.9,35.66 C7.1 | 73.46,38.1 R7.2
SW2_NO_DEBOUNCE
  Top 0.152: IC1.12 57.45,23.47 57.45,23.77 65.68,32 65.84,32 66.75,32.92 C7.2 66.9,32.92 67.97,32.92 68.58,32.31 70.1,32.31 R8.2 70.1,32.16 71.02,33.07 73.3,33.07 R7.1
SW3_BOUNCE
  Top 0.152: 69.19,21.95 69.65,22.4 70.87,22.4 R12.2 70.87,22.25 71.93,23.32 75.13,23.32 76.96,21.49 79.25,21.49 SW3.P$2 | 69.19,21.95 67.36,20.12 67.21,20.12 66.9,19.81 SW3_T.TP | 69.19,21.95 67.06,24.08 C8.1
SW3_NO_DEBOUNCE
  Top 0.152: R13.2 74.37,26.97 73.3,26.97 72.85,27.43 R12.1 67.97,27.43 67.21,26.67 C8.2 66.9,26.82 66.14,26.82 65.84,26.52 62.79,26.52 60.05,23.77 60.05,23.47 IC1.13
TX_BOARD
  Top 0.152: R3.1 54.52,10.32 TX_T.TP 48.59,14.05 44.74,14.05 44.6,14.18 44.6,21.33 46.08,22.8 46.08,23.94 45.27,24.74 44.14,24.74 43.33,23.94 43.33,22.61 43.02,22.3 39.18,22.3 38.15,23.33 38.15,23.81 37.53,24.43 36.64,24.43 35.58,23.37 IC1.3
(copper drawn outside any net)
  shapes: Top area x2